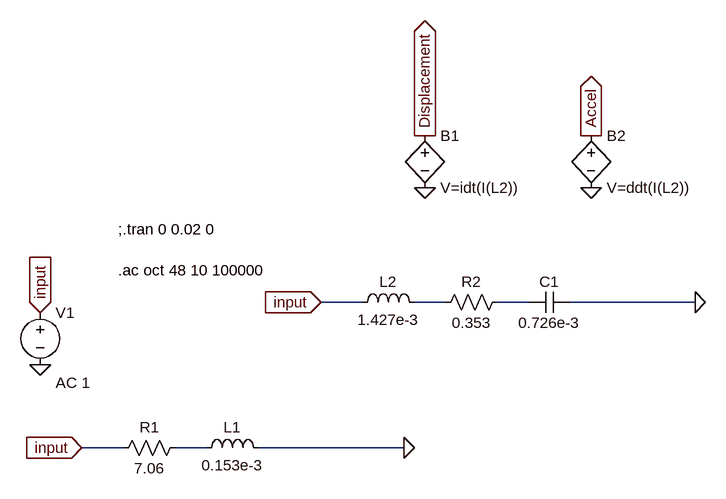
[diagram p0: schematic demo_01.asc]
demo_01.asc, the LTspice schematic file:
Version 4
SHEET 1 1060 680
WIRE 528 112 464 112
WIRE 656 112 608 112
WIRE 784 112 736 112
WIRE 1040 112 848 112
WIRE 160 336 96 336
WIRE 288 336 240 336
WIRE 592 336 368 336
FLAG 32 208 0
FLAG 32 128 input
IOPIN 32 128 In
FLAG 592 336 0
FLAG 96 336 input
IOPIN 96 336 In
FLAG 1040 112 0
FLAG 464 112 input
IOPIN 464 112 In
FLAG 624 -64 0
FLAG 880 -64 0
FLAG 624 -144 Displacement
IOPIN 624 -144 Out
FLAG 880 -144 Accel
IOPIN 880 -144 Out
SYMBOL voltage 32 112 R0
WINDOW 123 24 124 Left 2
WINDOW 39 0 0 Left 0
SYMATTR Value2 AC 1
SYMATTR InstName V1
SYMATTR Value ""
SYMBOL res 144 352 R270
WINDOW 0 32 56 VTop 2
WINDOW 3 0 56 VBottom 2
SYMATTR InstName R1
SYMATTR Value 7.06
SYMBOL ind 272 352 R270
WINDOW 0 32 56 VTop 2
WINDOW 3 5 56 VBottom 2
SYMATTR InstName L1
SYMATTR Value 0.153e-3
SYMBOL ind 512 128 R270
WINDOW 0 32 56 VTop 2
WINDOW 3 5 56 VBottom 2
SYMATTR InstName L2
SYMATTR Value 1.427e-3
SYMBOL res 640 128 R270
WINDOW 0 32 56 VTop 2
WINDOW 3 0 56 VBottom 2
SYMATTR InstName R2
SYMATTR Value 0.353
SYMBOL cap 784 128 R270
WINDOW 0 32 32 VTop 2
WINDOW 3 0 32 VBottom 2
SYMATTR InstName C1
SYMATTR Value 0.726e-3
SYMBOL bv 624 -160 R0
SYMATTR InstName B1
SYMATTR Value V=idt(I(L2))
SYMBOL bv 880 -160 R0
SYMATTR InstName B2
SYMATTR Value V=ddt(I(L2))
TEXT 152 0 Left 2 !;.tran 0 0.02 0\n\n.ac oct 48 10 100000

The netlist it stands for:
* demo_01.asc
V1 input 0 AC 1
R1 input N003 7.06
L1 N003 0 0.153e-3
L2 input N001 1.427e-3
R2 N001 N002 0.353
C1 N002 0 0.726e-3
B1 Displacement 0 V=idt(I(L2))
B2 Accel 0 V=ddt(I(L2))
;.tran 0 0.02 0
.ac oct 48 10 100000
.backanno
.end

* Results of the author's LTspice run, read from the files saved beside the schematic
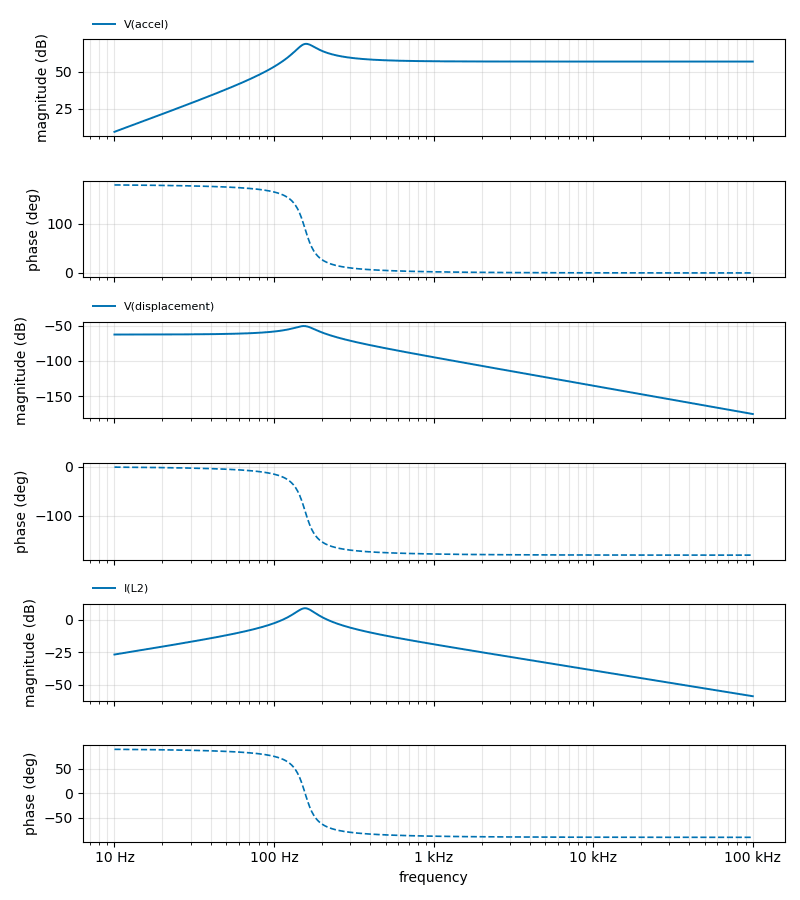
[diagram p1: AC Analysis of demo_01.asc, plotted from the saved traces]
* AC Analysis, 1 run:
*   V(accel): 9.18 dB at 10 Hz, 56.91 dB at 100 kHz, peak 68.95 dB at 160 Hz, 3 dB below the peak at 141.6 Hz and 184.6 Hz
*   V(displacement): -62.75 dB at 10 Hz, -175.02 dB at 100 kHz, peak -50.74 dB at 153.2 Hz, 3 dB below the peak at 132.5 Hz and 172.6 Hz
*   I(L2): -26.78 dB at 10 Hz, -59.05 dB at 100 kHz, peak 9.03 dB at 155.4 Hz, 3 dB below the peak at 137.9 Hz and 177.3 Hz